# EAGLE design shield (EAGLE 9.6.2)
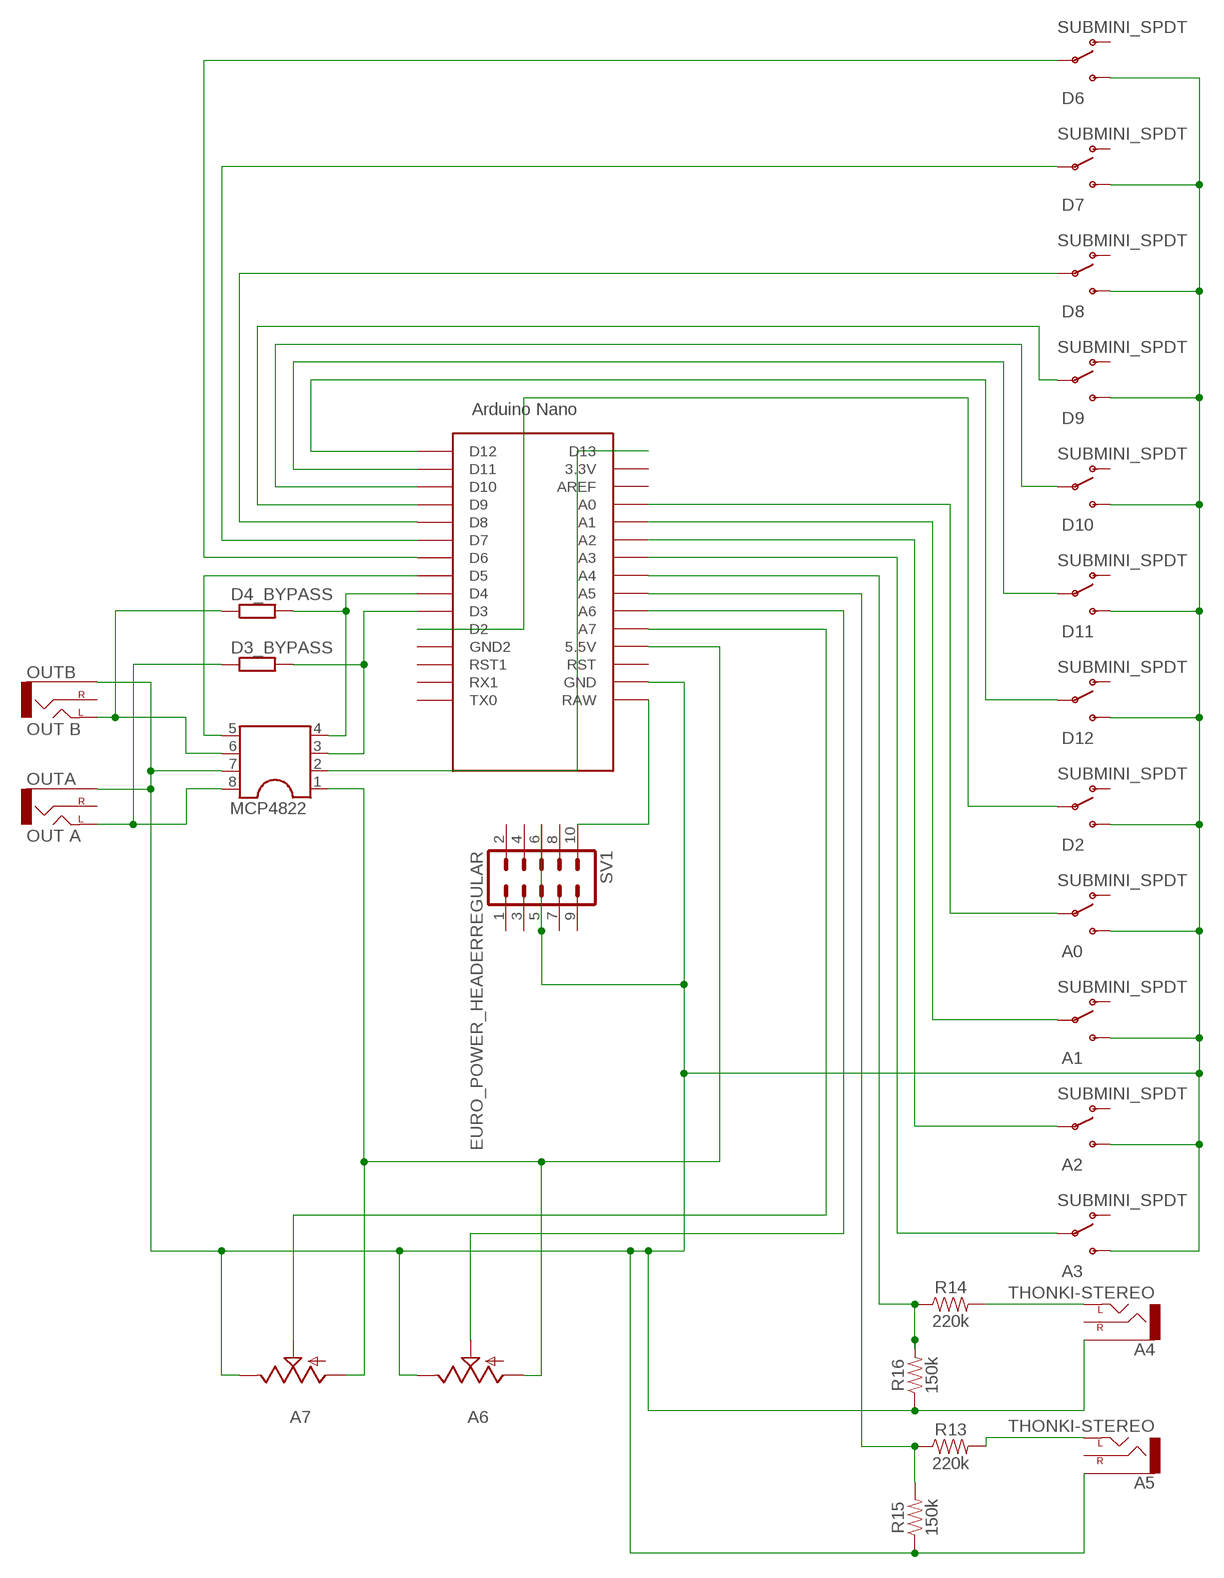
[diagram p0: schematic, sheet 1]

## Parts
A0  SUBMINI_SPDT  [SUBMINI_TOGGLE]
A1  SUBMINI_SPDT  [SUBMINI_TOGGLE]
A2  SUBMINI_SPDT  [SUBMINI_TOGGLE]
A3  SUBMINI_SPDT  [SUBMINI_TOGGLE]
A4  THONKI-STEREO  [WQP-PJ366ST_JACK]
A5  THONKI-STEREO  [WQP-PJ366ST_JACK]
A6  9MM_SNAP-IN_POT_  [9MM_SNAP-IN_POT]
A7  9MM_SNAP-IN_POT_  [9MM_SNAP-IN_POT]
D2  SUBMINI_SPDT  [SUBMINI_TOGGLE]
D3_BYPASS  RESISTOR7MM  [7MM_RESISTOR]
D4_BYPASS  RESISTOR7MM  [7MM_RESISTOR]
D6  SUBMINI_SPDT  [SUBMINI_TOGGLE]
D7  SUBMINI_SPDT  [SUBMINI_TOGGLE]
D8  SUBMINI_SPDT  [SUBMINI_TOGGLE]
D9  SUBMINI_SPDT  [SUBMINI_TOGGLE]
D10  SUBMINI_SPDT  [SUBMINI_TOGGLE]
D11  SUBMINI_SPDT  [SUBMINI_TOGGLE]
D12  SUBMINI_SPDT  [SUBMINI_TOGGLE]
MCP4822  DIL8  [DIL08]
OUTA  OUT A  THONKI-STEREO  [WQP-PJ366ST_JACK]
OUTB  OUT B  THONKI-STEREO  [WQP-PJ366ST_JACK]
R13  220k  10KOHM-HORIZ-1/4W-5%  [AXIAL-0.3]
R14  220k  10KOHM-HORIZ-1/4W-5%  [AXIAL-0.3]
R15  150k  10KOHM-HORIZ-1/4W-5%  [AXIAL-0.3]
R16  150k  10KOHM-HORIZ-1/4W-5%  [AXIAL-0.3]
SV1  EURO_POWER_HEADERREGULAR  [EURO_POWER_HEADER]
U$1  NANO  [NANO]

## Nets
N$1: SV1.10 U$1.RAW
N$2: A6.2(S) U$1.A6
N$3: A6.1(A) A7.1(A) MCP4822.1 U$1.5V(5.5V)
N$4: D6.COM(COMMON) U$1.D6
N$5: D7.COM(COMMON) U$1.D7
N$6: A7.2(S) U$1.A7
N$7: D9.COM(COMMON) U$1.D9
N$8: D10.COM(COMMON) U$1.D10
N$9: D11.COM(COMMON) U$1.D11
N$10: D12.COM(COMMON) U$1.D12
N$11: D2.COM(COMMON) U$1.D2
N$12: A0.COM(COMMON) U$1.A0
N$13: A1.COM(COMMON) U$1.A1
N$14: A2.COM(COMMON) U$1.A2
N$15: A3.COM(COMMON) U$1.A3
N$17: D3_BYPASS.1 MCP4822.8 OUTA.P$1_TIP(LEFT)
N$18: D4_BYPASS.1 MCP4822.6 OUTB.P$1_TIP(LEFT)
N$19: MCP4822.2 U$1.D13
N$20: D3_BYPASS.2 MCP4822.3 U$1.D3
N$21: D4_BYPASS.2 MCP4822.4 U$1.D4
N$22: MCP4822.5 U$1.D5
N$23: A0.3(S) A1.3(S) A2.3(S) A3.3(S) A4.P$3_SLEEVE(SLEEVE) A5.P$3_SLEEVE(SLEEVE) A6.3(E) A7.3(E) D2.3(S) D6.3(S) D7.3(S) D8.3(S) D9.3(S) D10.3(S) D11.3(S) D12.3(S) MCP4822.7 OUTA.P$3_SLEEVE(SLEEVE) OUTB.P$3_SLEEVE(SLEEVE) R15.P$1 R16.P$1 SV1.5 SV1.6 U$1.GND
N$24: D8.COM(COMMON) U$1.D8
N$25: A5.P$1_TIP(LEFT) R13.P$2
N$26: A4.P$1_TIP(LEFT) R14.P$2
N$29: R14.P$1 R16.P$2 U$1.A4
N$30: R13.P$1 R15.P$2 U$1.A5
Unconnected: A0.1(O) A1.1(O) A2.1(O) A3.1(O) A4.P$2_SWITCH(RIGHT) A5.P$2_SWITCH(RIGHT) D2.1(O) D6.1(O) D7.1(O) D8.1(O) D9.1(O) D10.1(O) D11.1(O) D12.1(O) OUTA.P$2_SWITCH(RIGHT) OUTB.P$2_SWITCH(RIGHT) SV1.1 SV1.2 SV1.3 SV1.4 SV1.7 SV1.8 SV1.9 U$1.3.3V U$1.AREF U$1.GND1(GND2) U$1.ICSP1 U$1.ICSP2 U$1.ICSP3 U$1.ICSP4 U$1.ICSP5 U$1.ICSP6 U$1.RST U$1.RST1 U$1.RX1 U$1.TX0

## Library data of the parts
A0 A1-A3 D2 D6-D12 = MusicThingModular:SUBMINI_SPDT
A4 A5 OUTA OUTB = MusicThingModular:THONKI-STEREO: 3.5mm socket for Eurorack modular synths
A6 A7 = MusicThingModular:9MM_SNAP-IN_POT: 9mm vertical snap-in pot, Alpha / Panasonic style
D3_BYPASS D4_BYPASS = MusicThingModular:RESISTOR: Standard resistor, various versions
MCP4822 = ic-package:DIL8: Dual In Line / Socket
R13-R16 = SparkFun-Resistors:10KOHM: 10kΩ resistor A resistor is a passive two-terminal electrical component that implements electrical resistance as a circuit element. Resistors act to reduce current flow, and, at the same time, act to lower voltage levels within circuits. - Wikipedia; PROD_ID: RES-09435; VALUE: 10k
SV1 = MusicThingModular:EURO_POWER_HEADER: Power Header 10 pin power header for Eurorack Power Supplies Variants with fatter pads for easier soldering, and the LOCK variant which has 5mil offset pins to hold the component in place before soldering
U$1 = Arduino-clone:NANO: Arduino Nano

## Board
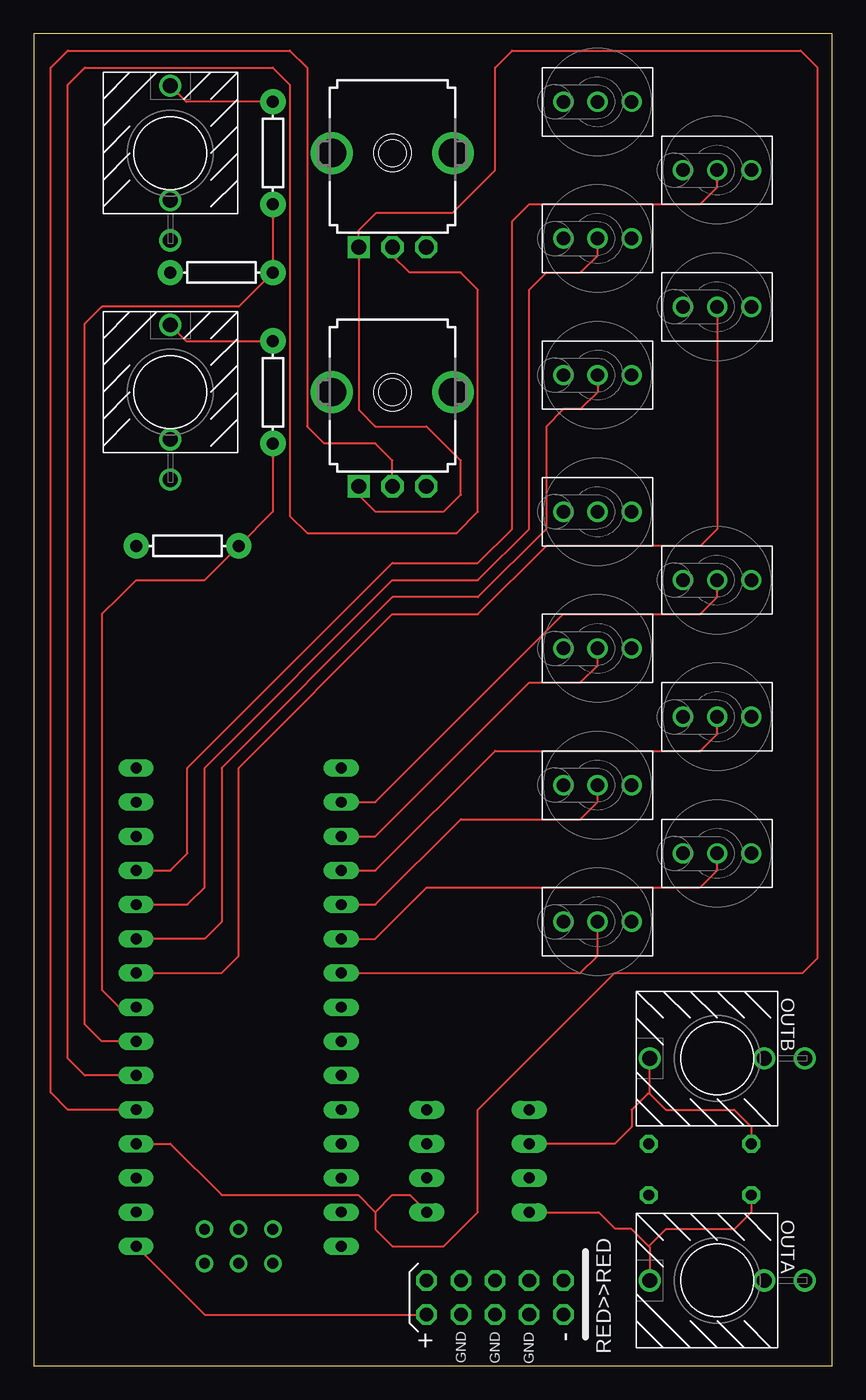
[diagram p1: board, top side]
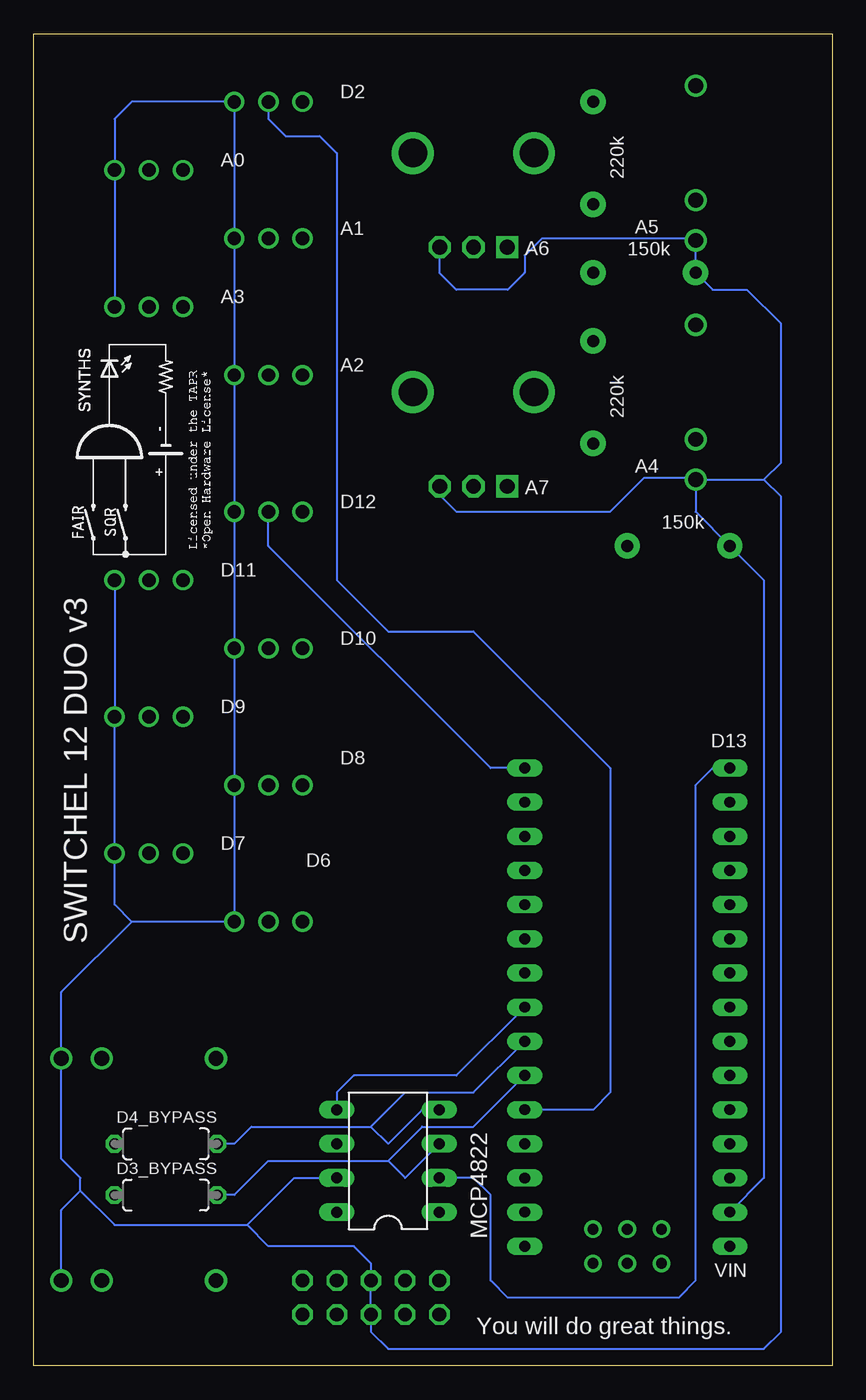
[diagram p2: board, bottom side, seen from below]

Size 59.36 x 99.05 mm. Coordinates in mm from the lower left corner, seen from the top.
Outline: 0,0 59.36,0 59.36,99.05 0,99.05 0,0
Copper layers (1*16): Top 0.035mm / dielectric 1.5mm / Bottom 0.035mm
Design rules "default": minimum track width 6mil, minimum drill 0.35mm, track to track 6mil, track to pad 6mil, pad to pad 6mil, via to via 6mil, smd to smd 6mil, copper to edge 40mil, drill to drill 6mil, minimum pad ring 10mil, minimum via ring 8mil, stop-mask expansion 4mil, vias tented up to drill 0mil, thermal gap 10mil

### Footprints (pad centres in the part's own frame; a part is rotated, then mirrored left to right if it is on the bottom)
SUBMINI_TOGGLE = drill 1 pad 1.422: 1 -2.54,0; 3 2.54,0; COM 0,0
WQP-PJ366ST_JACK = drill 1.1: P$1_TIP 0,5; P$2_SWITCH 0,-3.5; P$3_SLEEVE 0,-6.5
9MM_SNAP-IN_POT = drill 1.1 square: 1 -2.5,-7 | drill 1.1 octagon: 2 0,-7; 3 2.5,-7 | drill 2.1 pad 2.794: CHASSIS1 -4.5,0; CHASSIS2 4.5,0
7MM_RESISTOR = drill 0.813 octagon: 1 -3.81,0; 2 3.81,0
DIL08 = drill 0.813 long: 1 -3.81,-3.81; 2 -1.27,-3.81; 3 1.27,-3.81; 4 3.81,-3.81; 5 3.81,3.81; 6 1.27,3.81; 7 -1.27,3.81; 8 -3.81,3.81
AXIAL-0.3 = drill 0.9 pad 1.88: P$1 -3.81,0; P$2 3.81,0
EURO_POWER_HEADER = drill 1.016 octagon: 1 -5.08,-1.27; 2 -5.08,1.27; 3 -2.54,-1.27; 4 -2.54,1.27; 5 0,-1.27; 6 0,1.27; 7 2.54,-1.27; 8 2.54,1.27; 9 5.08,-1.27; 10 5.08,1.27
NANO = drill 0.8 long: 3.3V -10.16,24.13; 5V -10.16,-1.27; A0 -10.16,19.05; A1 -10.16,16.51; A2 -10.16,13.97; A3 -10.16,11.43; A4 -10.16,8.89; A5 -10.16,6.35; A6 -10.16,3.81; A7 -10.16,1.27; AREF -10.16,21.59; D2 5.08,1.27; D3 5.08,3.81; D4 5.08,6.35; D5 5.08,8.89; D6 5.08,11.43; D7 5.08,13.97; D8 5.08,16.51; D9 5.08,19.05; D10 5.08,21.59; D11 5.08,24.13; D12 5.08,26.67; D13 -10.16,26.67; GND -10.16,-6.35; GND1 5.08,-1.27; RAW -10.16,-8.89; RST -10.16,-3.81; RST1 5.08,-3.81; RX1 5.08,-6.35; TX0 5.08,-8.89 | drill 0.8: ICSP1 -5.08,-10.16; ICSP2 -5.08,-7.62; ICSP3 -2.54,-10.16; ICSP4 -2.54,-7.62; ICSP5 0,-10.16; ICSP6 0,-7.62

### Placement (x,y rotation side)
A0  50.8,88.9 0 top
A1  41.91,83.82 0 top
A2  41.91,73.66 0 top
A3  50.8,78.74 0 top
A4  10.16,72.39 0 top
A5  10.16,90.17 0 top
A6  26.67,90.17 0 top
A7  26.67,72.39 0 top
D2  41.91,93.98 0 top
D3_BYPASS  49.53,12.7 0 bottom
D4_BYPASS  49.53,16.51 0 bottom
D6  41.91,33.02 0 top
D7  50.8,38.1 0 top
D8  41.91,43.18 0 top
D9  50.8,48.26 0 top
D10  41.91,53.34 0 top
D11  50.8,58.42 0 top
D12  41.91,63.5 0 top
MCP4822  33.02,15.24 90 bottom
OUTA  50.8,6.35 90 top
OUTB  50.8,22.86 90 top
R13  17.78,90.17 90 top
R14  17.78,72.39 90 top
R15  13.97,81.28 0 top
R16  11.43,60.96 0 top
SV1  34.29,5.08 180 top
U$1  17.78,17.78 0 top

### Tracks (layer width: path | path; a pad name or v marks a point on that pad's centre or on a via)
N$1
  Top 0.152: U$1.RAW 12.7,3.81 SV1.10
N$2
  Top 0.152: U$1.A6 3.81,21.59 2.54,22.86 2.54,95.25 3.81,96.52 17.78,96.52 19.05,95.25 19.05,63.2 20.32,61.92 31.45,61.92 33.02,63.5 33.02,80.01 31.75,81.28 27.94,81.28 26.67,82.55 A6.2
N$3
  Top 0.152: 25.4,11.43 24.13,12.7 13.97,12.7 10.16,16.51 U$1.5V | 25.4,11.43 25.4,10.16 26.67,8.89 30.48,8.89 33.02,11.43 33.02,19.05 43.18,29.21 57.15,29.21 58.27,30.33 58.27,96.52 57,97.79 35.56,97.79 34.29,96.52 34.29,88.9 31.1,85.71 25.44,85.71 24.17,84.44 A6.1 24.17,71.08 25.4,69.85 29.21,69.85 31.75,67.31 31.75,64.77 30.48,63.5 25.4,63.5 24.17,64.73 A7.1 | 25.4,11.43 26.67,12.7 27.94,12.7 MCP4822.1
N$4
  Top 0.152: U$1.D6 40.64,29.21 41.91,30.48 D6.COM
N$5
  Top 0.152: U$1.D7 25.4,31.75 29.21,35.56 49.53,35.56 50.8,36.83 D7.COM
N$6
  Top 0.152: U$1.A7 2.54,19.05 1.27,20.32 1.27,96.52 2.54,97.79 19.05,97.79 20.32,96.52 20.32,69.85 21.59,68.58 25.4,68.58 26.67,67.31 A7.2
N$7
  Top 0.152: U$1.D9 25.4,36.83 34.29,45.72 49.53,45.72 50.8,46.99 D9.COM
N$8
  Top 0.152: U$1.D10 25.4,39.37 36.83,50.8 40.64,50.8 41.91,52.07 D10.COM
N$9
  Top 0.152: U$1.D11 25.4,41.91 39.37,55.88 49.53,55.88 50.8,57.15 D11.COM
N$10
  Bottom 0.152: U$1.D12 25.4,44.45 41.91,60.96 D12.COM
N$11
  Bottom 0.152: D2.COM 41.91,92.71 40.64,91.44 38.1,91.44 36.83,90.17 36.83,58.42 33.02,54.61 26.67,54.61 16.51,44.45 16.51,20.32 17.78,19.05 U$1.D2
N$12
  Top 0.152: A0.COM 50.8,87.63 49.53,86.36 36.83,86.36 35.56,85.09 35.56,62.23 33.02,59.69 26.67,59.69 11.43,44.45 11.43,38.1 10.16,36.83 U$1.A0
N$13
  Top 0.152: U$1.A1 11.43,34.29 12.7,35.56 12.7,44.45 26.67,58.42 33.02,58.42 36.83,62.23 36.83,80.01 38.1,81.28 40.64,81.28 41.91,82.55 A1.COM
N$14
  Top 0.152: A2.COM 41.91,72.39 40.64,71.12 39.37,71.12 38.1,69.85 38.1,62.23 33.02,57.15 26.67,57.15 13.97,44.45 13.97,33.02 12.7,31.75 U$1.A2
N$15
  Top 0.152: A3.COM 50.8,62.23 49.53,60.96 38.1,60.96 33.02,55.88 26.67,55.88 15.24,44.45 15.24,30.48 13.97,29.21 U$1.A3
N$17
  Top 0.152: MCP4822.8 41.99,11.43 43.22,10.2 44.41,10.2 45.72,8.89 | D3_BYPASS.1 53.34,11.43 52.07,10.16 46.99,10.16 45.72,8.89 | 45.72,8.89 45.8,8.81 OUTA.P$1_TIP
N$18
  Top 0.152: MCP4822.6 43.18,16.51 44.45,17.78 44.45,19.05 45.64,20.24 45.8,20.24 | 45.8,20.24 OUTB.P$1_TIP | D4_BYPASS.1 53.34,17.78 52.07,19.05 46.99,19.05 45.8,20.24
N$19
  Bottom 0.152: U$1.D13 8.89,44.45 10.16,43.18 10.16,6.35 11.43,5.08 24.13,5.08 25.4,6.35 25.4,12.7 26.67,13.97 MCP4822.2
N$20
  Bottom 0.152: D3_BYPASS.2 44.45,12.7 41.91,15.24 33.02,15.24 | 33.02,15.24 31.75,13.97 MCP4822.3 | U$1.D3 26.67,17.78 30.48,17.78 33.02,15.24
N$21
  Bottom 0.152: D4_BYPASS.2 44.45,16.51 43.18,17.78 34.29,17.78 | 34.29,17.78 33.02,16.51 30.48,19.05 MCP4822.4 | 34.29,17.78 31.75,20.32 26.67,20.32 U$1.D4
N$22
  Bottom 0.152: U$1.D5 27.94,21.59 35.56,21.59 36.83,20.32 MCP4822.5
N$23
  Bottom 0.152: U$1.GND 5.08,13.97 5.08,58.42 R16.P$1 10.16,63.5 A4.P$3_SLEEVE | 5.08,65.89 3.81,67.16 3.81,77.47 6.35,80.01 8.89,80.01 R15.P$1 A5.P$3_SLEEVE 10.31,83.82 21.59,83.82 22.86,82.55 22.86,81.28 24.13,80.01 27.94,80.01 29.17,81.24 A6.3 | 5.08,65.89 3.81,64.62 3.81,2.54 5.08,1.27 33.02,1.27 34.29,2.54 SV1.6 SV1.5 34.29,7.62 35.56,8.89 41.91,8.89 43.5,10.48 | A4.P$3_SLEEVE 5.08,65.89 | 43.5,10.48 53.34,10.48 55.88,13.02 | 43.5,10.48 40.01,13.97 MCP4822.7 | 55.88,13.02 55.88,13.97 57.3,15.39 OUTB.P$3_SLEEVE 57.3,27.79 52.07,33.02 | 55.88,13.02 57.3,11.6 OUTA.P$3_SLEEVE | A7.3 29.17,64.73 27.94,63.5 16.51,63.5 13.97,66.04 10.31,66.04 A4.P$3_SLEEVE | A3.3 A0.3 53.34,92.71 52.07,93.98 D2.3 A1.3 A2.3 D12.3 D10.3 D8.3 D6.3 52.07,33.02 | 52.07,33.02 53.34,34.29 D7.3 D9.3 D11.3
N$24
  Top 0.152: D8.COM 41.91,41.91 40.64,40.64 31.75,40.64 25.4,34.29 U$1.D8
N$25
  Top 0.152: R13.P$2 11.35,93.98 A5.P$1_TIP
N$26
  Top 0.152: A4.P$1_TIP 11.39,76.16 17.74,76.16 R14.P$2
N$29
  Top 0.152: U$1.A4 6.35,26.67 5.08,27.94 5.08,55.88 6.35,57.15 | 6.35,57.15 7.62,58.42 12.7,58.42 R16.P$2 17.78,63.5 R14.P$1 | 6.35,57.15
N$30
  Top 0.152: R13.P$1 R15.P$2 15.24,78.74 5.08,78.74 3.81,77.47 3.81,25.4 5.08,24.13 U$1.A5

### Text on the board
bNames: 220k | 150k | 220k | 150k | SWITCHEL 12 DUO v3 | D13 | VIN | You will do great things.